# EAGLE schematic MiniRobot (EAGLE 8.3.2)

## Sheet 1 of 3
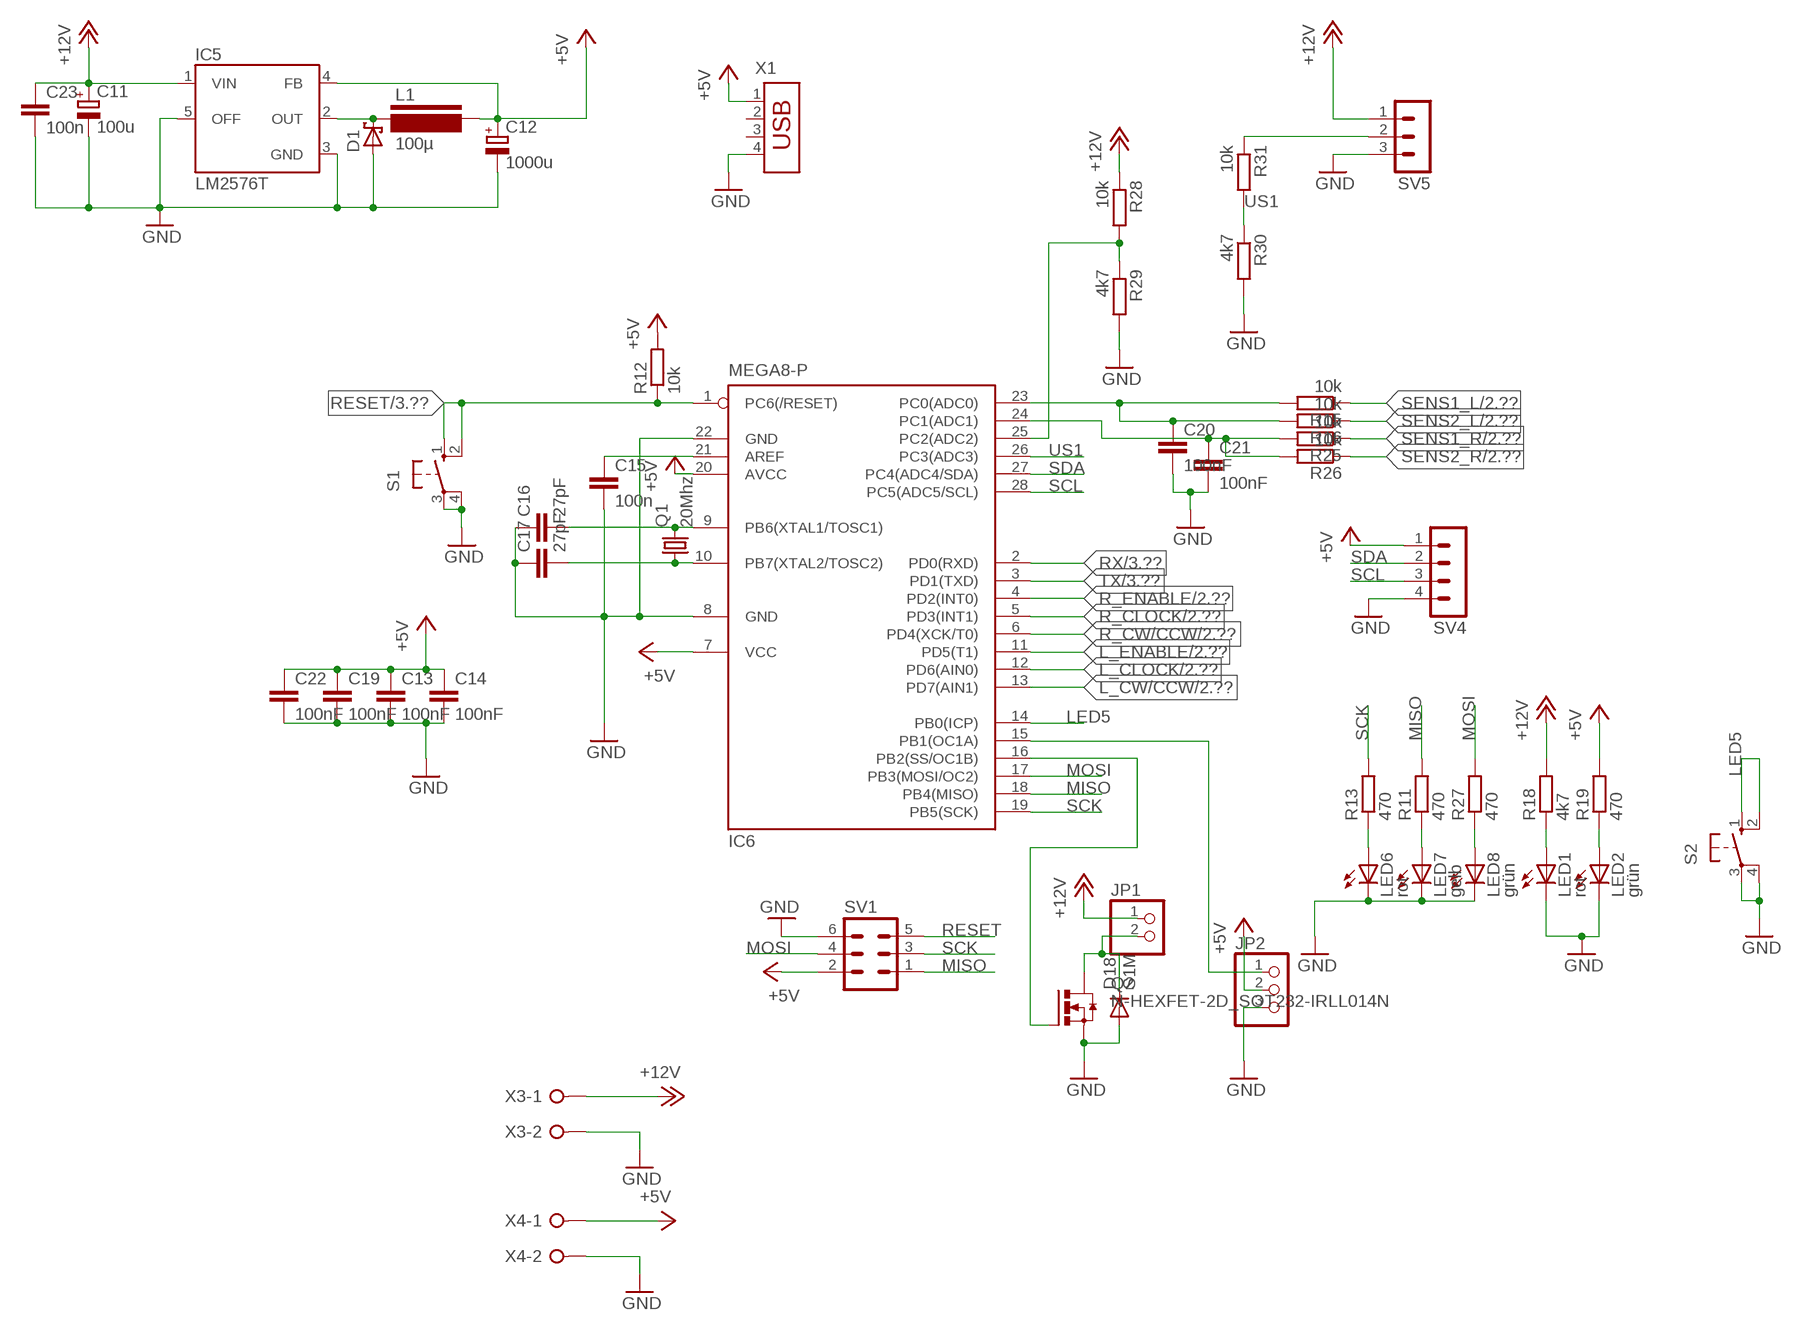
[diagram p0: schematic, sheet 1]

### Parts
C11  100u  CPOL-EUE5-10.5  [E5-10,5]
C12  1000u  CPOL-EUE5-10.5  [E5-10,5]
C13  100nF  C-EUC0805  [C0805]
C14  100nF  C-EUC0805  [C0805]
C15  100n  C-EUC0805  [C0805]
C16  27pF  C-EUC0805  [C0805]
C17  27pF  C-EUC0805  [C0805]
C19  100nF  C-EUC0805  [C0805]
C20  100nF  C-EUC0805  [C0805]
C21  100nF  C-EUC0805  [C0805]
C22  100nF  C-EUC0805  [C0805]
C23  100n  C-EUC0805  [C0805]
D1  SCHOTTKY-DIODEF126Z12  [F126Z12]
D18  S1M  [SMA]
IC5  LM2576T  [TO220-5]
IC6  MEGA8-P  [DIL28-3]
JP1  PINHD-1X2  [1X02]
JP2  PINHD-1X3  [1X03]
L1  100µ  L-PISR  [PISR]
LED1  rot  LEDCHIP-LED0805  [CHIP-LED0805]
LED2  grün  LEDCHIP-LED0805  [CHIP-LED0805]
LED6  rot  LEDCHIP-LED0805  [CHIP-LED0805]
LED7  gelb  LEDCHIP-LED0805  [CHIP-LED0805]
LED8  grün  LEDCHIP-LED0805  [CHIP-LED0805]
Q1  20Mhz  CSM-7X-DU  [CSM-7X-DU]
Q2  N-HEXFET-2D_SOT232-IRLL014N  [SOT223]
R11  470  R-EU_M0805  [M0805]
R12  10k  R-EU_R0805  [R0805]
R13  470  R-EU_M0805  [M0805]
R15  10k  R-EU_R0805  [R0805]
R16  10k  R-EU_M0805  [M0805]
R18  4k7  R-EU_R0805  [R0805]
R19  470  R-EU_M0805  [M0805]
R25  10k  R-EU_M0805  [M0805]
R26  10k  R-EU_M0805  [M0805]
R27  470  R-EU_R0805  [R0805]
R28  10k  R-EU_M0805  [M0805]
R29  4k7  R-EU_M0805  [M0805]
R30  4k7  R-EU_R0805  [R0805]
R31  10k  R-EU_R0805  [R0805]
S1  10-XX  [B3F-10XX]
S2  10-XX  [B3F-10XX]
SV1  ML6  [ML6]
SV4  MA04-1  [MA04-1]
SV5  MA03-1  [MA03-1]
X1  USB-787616  [USB]
X3  W237-02P  [W237-132]
X4  W237-02P  [W237-132]

### Nets
+5V: C12.+ C13.1 C14.1 C19.1 C22.1 IC5.4(FB) IC6.7(VCC) IC6.20(AVCC) JP2.2 L1.P$2 R12.2 R19.2 SV1.2 SV4.1 X1.1 X4.1 ; also sheet 2,3
+12V: C11.+ C23.1 IC5.1(VIN) JP1.1 R18.2 R28.1 SV5.1 X3.1 ; also sheet 2
GND: C11.- C12.- C13.2 C14.2 C15.2 C16.1 C17.1 C19.2 C20.2 C21.2 C22.2 C23.2 D1.A D18.A IC5.3(GND) IC5.5(OFF) IC6.8(GND) IC6.22(GND) JP2.3 LED1.C LED2.C LED6.C LED7.C LED8.C Q2.3(S) R29.2 R30.2 S1.3(P) S1.4(P1) S2.3(P) S2.4(P1) SV1.6 SV4.4 SV5.3 X1.4 X3.2 X4.2 ; also sheet 2,3
L_CLOCK: IC6.12(PD6(AIN0)) ; also sheet 2
L_CW/CCW: IC6.13(PD7(AIN1)) ; also sheet 2
L_ENABLE: IC6.11(PD5(T1)) ; also sheet 2
LED5: IC6.14(PB0(ICP)) S2.1(S) S2.2(S1)
MISO: IC6.18(PB4(MISO)) R11.2 SV1.1
MOSI: IC6.17(PB3(MOSI/OC2)) R27.2 SV1.4
N$8: LED8.A R27.1
N$9: C21.1 IC6.24(PC1(ADC1)) R25.2 R26.2
N$22: C15.1 IC6.21(AREF)
N$28: C16.2 IC6.9(PB6(XTAL1/TOSC1)) Q1.2
N$29: D1.C IC5.2(OUT) L1.P$1
N$31: IC6.25(PC2(ADC2)) R28.2 R29.1
N$35: C17.2 IC6.10(PB7(XTAL2/TOSC2)) Q1.1
N$38: C20.1 IC6.23(PC0(ADC0)) R15.2 R16.2
N$39: LED1.A R18.1
N$40: LED2.A R19.1
N$42: LED6.A R13.1
N$43: LED7.A R11.1
N$44: R31.1 SV5.2
N$46: D18.C JP1.2 Q2.2(D) Q2.4(D)
N$47: IC6.16(PB2(SS/OC1B)) Q2.1(G)
N$48: IC6.15(PB1(OC1A)) JP2.1
R_CLOCK: IC6.5(PD3(INT1)) ; also sheet 2
R_CW/CCW: IC6.6(PD4(XCK/T0)) ; also sheet 2
R_ENABLE: IC6.4(PD2(INT0)) ; also sheet 2
RESET: IC6.1(PC6(/RESET)) R12.1 S1.1(S) S1.2(S1) SV1.5 ; also sheet 3
RX: IC6.2(PD0(RXD)) ; also sheet 3
SCK: IC6.19(PB5(SCK)) R13.2 SV1.3
SCL: IC6.28(PC5(ADC5/SCL)) SV4.3
SDA: IC6.27(PC4(ADC4/SDA)) SV4.2
SENS1_L: R15.1 ; also sheet 2
SENS1_R: R25.1 ; also sheet 2
SENS2_L: R16.1 ; also sheet 2
SENS2_R: R26.1 ; also sheet 2
TX: IC6.3(PD1(TXD)) ; also sheet 3
US1: IC6.26(PC3(ADC3)) R30.1 R31.2
Unconnected: X1.2 X1.3

## Sheet 2 of 3: Motor drivers
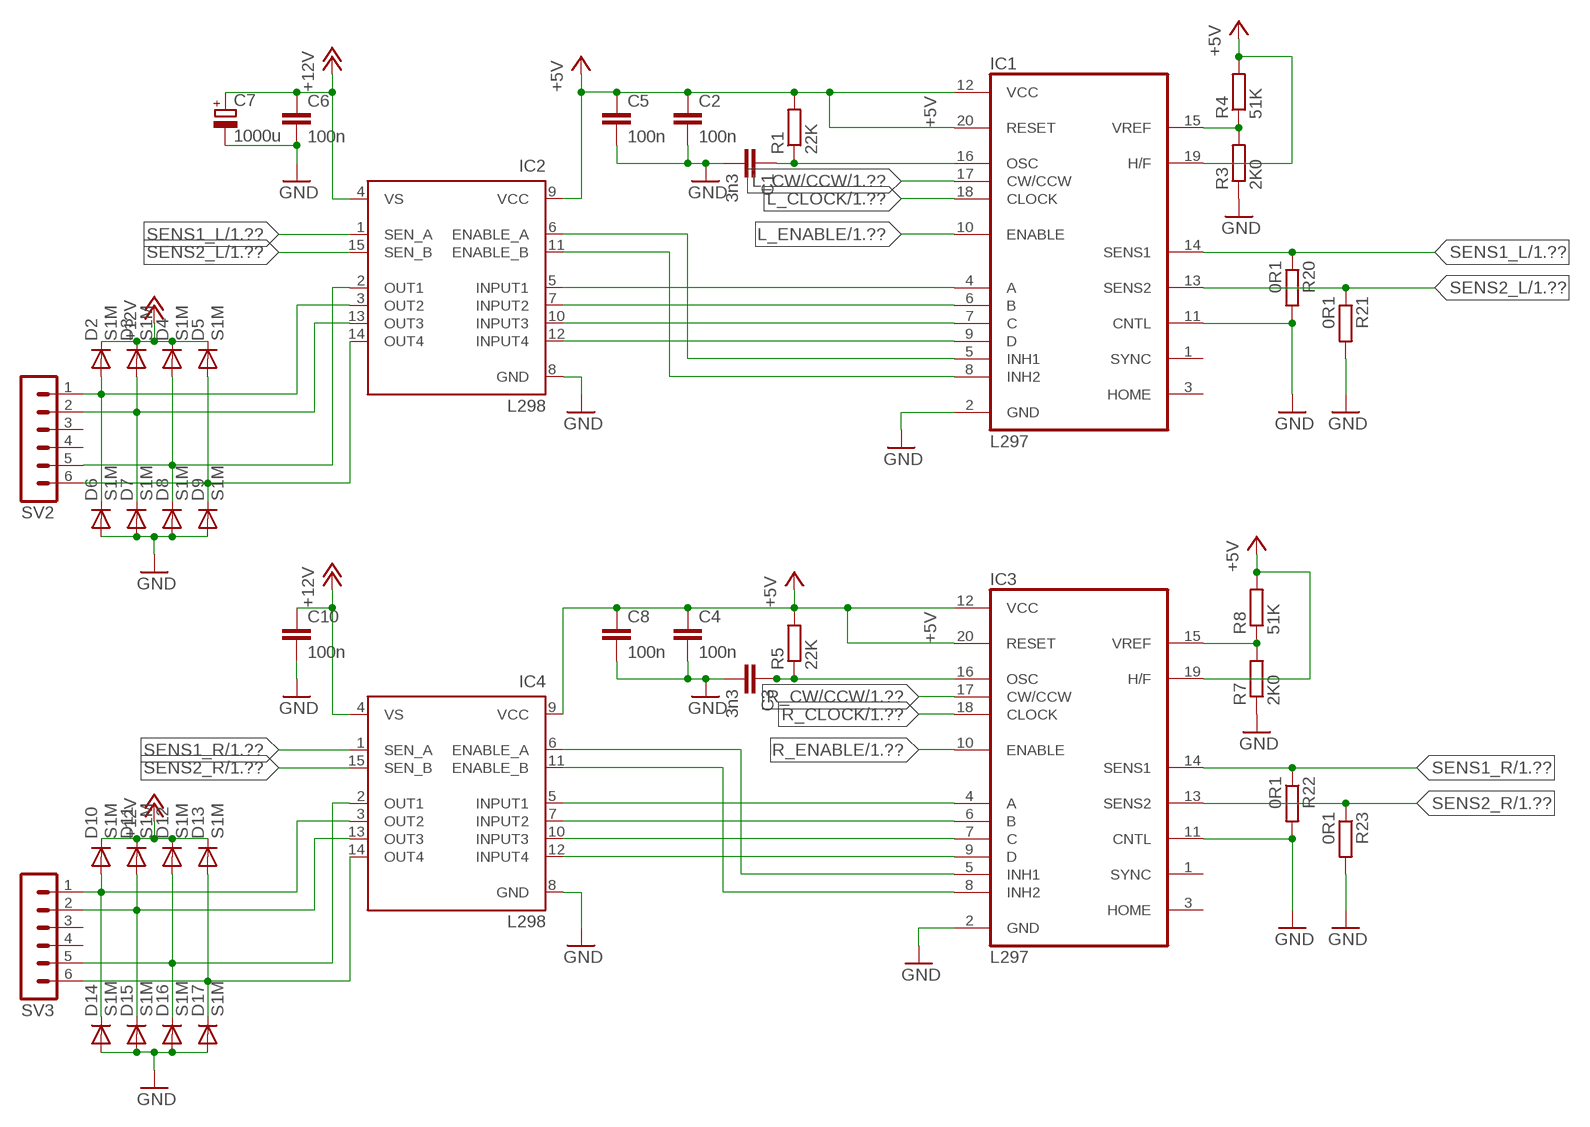
[diagram p1: schematic, sheet 2]

### Parts
C1  3n3  C-EUC0805  [C0805]
C2  100n  C-EUC0805  [C0805]
C3  3n3  C-EUC0805  [C0805]
C4  100n  C-EUC0805  [C0805]
C5  100n  C-EUC0805  [C0805]
C6  100n  C-EUC0805  [C0805]
C7  1000u  CPOL-EUE5-10.5  [E5-10,5]
C8  100n  C-EUC0805  [C0805]
C10  100n  C-EUC0805  [C0805]
D2  S1M  [SMA]
D3  S1M  [SMA]
D4  S1M  [SMA]
D5  S1M  [SMA]
D6  S1M  [SMA]
D7  S1M  [SMA]
D8  S1M  [SMA]
D9  S1M  [SMA]
D10  S1M  [SMA]
D11  S1M  [SMA]
D12  S1M  [SMA]
D13  S1M  [SMA]
D14  S1M  [SMA]
D15  S1M  [SMA]
D16  S1M  [SMA]
D17  S1M  [SMA]
IC1  L297  [DIL20]
IC2  L298  [MULTIWATT-15]
IC3  L297  [DIL20]
IC4  L298  [MULTIWATT-15]
R1  22K  R-EU_R0805  [R0805]
R3  2K0  R-EU_R0805  [R0805]
R4  51K  R-EU_R0805  [R0805]
R5  22K  R-EU_R0805  [R0805]
R7  2K0  R-EU_R0805  [R0805]
R8  51K  R-EU_R0805  [R0805]
R20  0R1  R-EU_0613/15  [P0613/15]
R21  0R1  R-EU_0613/15  [P0613/15]
R22  0R1  R-EU_0613/15  [P0613/15]
R23  0R1  R-EU_0613/15  [P0613/15]
SV2  MA06-1  [MA06-1]
SV3  MA06-1  [MA06-1]

### Nets
+5V: C2.1 C4.1 C5.1 C8.1 IC1.12(VCC) IC1.19(H/F) IC1.20(RESET) IC2.9(VCC) IC3.12(VCC) IC3.19(H/F) IC3.20(RESET) IC4.9(VCC) R1.2 R4.2 R5.2 R8.2 ; also sheet 1,3
+12V: C6.1 C7.+ C10.1 D2.C D3.C D4.C D5.C D10.C D11.C D12.C D13.C IC2.4(VS) IC4.4(VS) ; also sheet 1
GND: C1.2 C2.2 C3.2 C4.2 C5.2 C6.2 C7.- C8.2 C10.2 D6.A D7.A D8.A D9.A D14.A D15.A D16.A D17.A IC1.2(GND) IC1.11(CNTL) IC2.8(GND) IC3.2(GND) IC3.11(CNTL) IC4.8(GND) R3.1 R7.1 R20.2 R21.2 R22.2 R23.2 ; also sheet 1,3
L_CLOCK: IC1.18(CLOCK) ; also sheet 1
L_CW/CCW: IC1.17(CW/CCW) ; also sheet 1
L_ENABLE: IC1.10(ENABLE) ; also sheet 1
N$1: C1.1 IC1.16(OSC) R1.1
N$2: IC1.4(A) IC2.5(INPUT1)
N$3: IC1.6(B) IC2.7(INPUT2)
N$4: IC1.7(C) IC2.10(INPUT3)
N$5: C3.1 IC3.16(OSC) R5.1
N$6: IC3.6(B) IC4.7(INPUT2)
N$7: IC1.9(D) IC2.12(INPUT4)
N$10: IC1.5(INH1) IC2.6(ENABLE_A)
N$11: IC1.15(VREF) R3.2 R4.1
N$12: D4.A D8.C IC2.2(OUT1) SV2.5
N$14: IC3.4(A) IC4.5(INPUT1)
N$15: IC3.7(C) IC4.10(INPUT3)
N$16: IC3.9(D) IC4.12(INPUT4)
N$17: IC3.15(VREF) R7.2 R8.1
N$19: IC3.5(INH1) IC4.6(ENABLE_A)
N$20: IC1.8(INH2) IC2.11(ENABLE_B)
N$23: D2.A D6.C IC2.3(OUT2) SV2.1
N$24: D3.A D7.C IC2.13(OUT3) SV2.2
N$25: D5.A D9.C IC2.14(OUT4) SV2.6
N$26: IC3.8(INH2) IC4.11(ENABLE_B)
N$30: D10.A D14.C IC4.3(OUT2) SV3.1
N$32: D12.A D16.C IC4.2(OUT1) SV3.5
N$33: D13.A D17.C IC4.14(OUT4) SV3.6
N$34: D11.A D15.C IC4.13(OUT3) SV3.2
R_CLOCK: IC3.18(CLOCK) ; also sheet 1
R_CW/CCW: IC3.17(CW/CCW) ; also sheet 1
R_ENABLE: IC3.10(ENABLE) ; also sheet 1
SENS1_L: IC1.14(SENS1) IC2.1(SEN_A) R20.1 ; also sheet 1
SENS1_R: IC3.14(SENS1) IC4.1(SEN_A) R22.1 ; also sheet 1
SENS2_L: IC1.13(SENS2) IC2.15(SEN_B) R21.1 ; also sheet 1
SENS2_R: IC3.13(SENS2) IC4.15(SEN_B) R23.1 ; also sheet 1
Unconnected: IC1.1(SYNC) IC1.3(HOME) IC3.1(SYNC) IC3.3(HOME) SV2.3 SV2.4 SV3.3 SV3.4

## Sheet 3 of 3: FT232RL
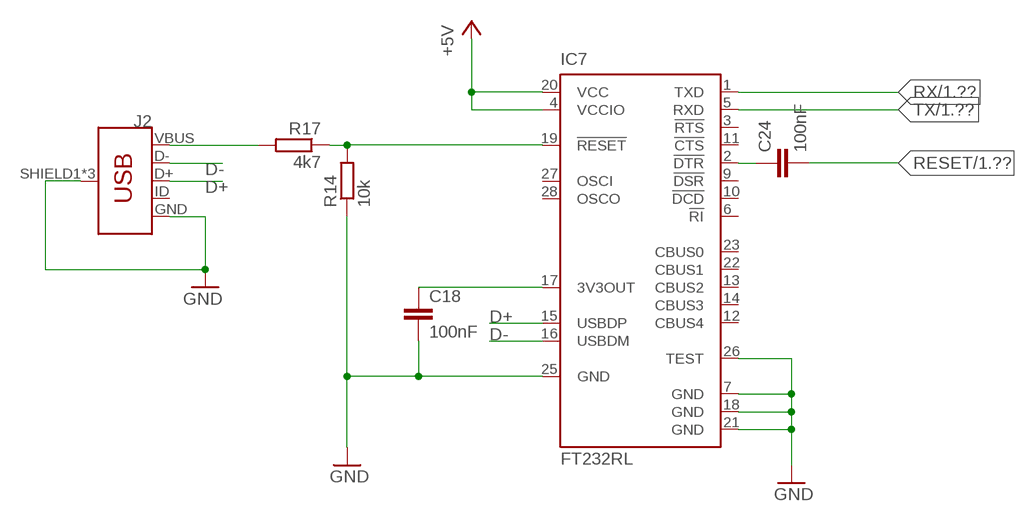
[diagram p2: schematic, sheet 3]

### Parts
C18  100nF  C-EUC0805  [C0805]
C24  100nF  C-EUC0805  [C0805]
IC7  FT232RL  [SSOP28]
J2  USB_MICRO-B_FEMALE-SMT  [USB-B-MICRO-SMD]
R14  10k  R-EU_M0805  [M0805]
R17  4k7  R-EU_M0805  [M0805]

### Nets
+5V: IC7.4(VCCIO) IC7.20(VCC) ; also sheet 1,2
D+: IC7.15(USBDP) J2.D+
D-: IC7.16(USBDM) J2.D-
GND: C18.2 IC7.7(GND) IC7.18(GND) IC7.21(GND) IC7.25(GND) IC7.26(TEST) J2.GND J2.SHIELD1(SHIELD) J2.SHIELD2(SHIELD) J2.SHIELD3(SHIELD) R14.1 ; also sheet 1,2
N$27: J2.VBUS R17.2
N$36: IC7.19(!RESET) R14.2 R17.1
N$37: C18.1 IC7.17(3V3OUT)
N$45: C24.1 IC7.2(!DTR)
RESET: C24.2 ; also sheet 1
RX: IC7.1(TXD) ; also sheet 1
TX: IC7.5(RXD) ; also sheet 1
Unconnected: IC7.3(!RTS) IC7.6(!RI) IC7.9(!DSR) IC7.10(!DCD) IC7.11(!CTS) IC7.12(CBUS4) IC7.13(CBUS2) IC7.14(CBUS3) IC7.22(CBUS1) IC7.23(CBUS0) IC7.27(OSCI) IC7.28(OSCO) J2.ID

## Library data of the parts
C1-C6 C8 C10 C23 = resistor:C-EU: CAPACITOR, European symbol
C7 C11 C12 = resistor:CPOL-EU: POLARIZED CAPACITOR, European symbol
C13-C22 C24 = rcl:C-EU: CAPACITOR, European symbol
D1 = diode:SCHOTTKY-DIODE: Schottky Diode
D2-D18 = diode:S1M
IC1 IC3 = st-microelectronics:L297: STEPPER MOTOR CONTROLLER; MPN: L297/1; OC_FARNELL: 1094209; OC_NEWARK: 56P8258
IC2 IC4 = st-microelectronics:L298: DUAL FULL-BRIDGE DRIVER; MPN: L298N; OC_FARNELL: 1589425; OC_NEWARK: 32M1527
IC5 = v-reg-3:LM2576: National Semiconductor <http://www.national.com> 3.0A "Simple Switcher"(c) 52kHz, Vout 1.23-37V (HV: 57V), Vin 40V (HV: 60V), 50µA standby current
IC6 = atmel:MEGA8-P: MICROCONTROLLER 8 Kbytes FLASH, 1 kbytes SRAM, 512 bytes EEPROM, USART, 4-channel 10 bit ADC, 2-channel 8 bit ADC Pin compatible with Atmega48, ATMega88, ATMega168 Source: avr.lbr; OC_FARNELL: unknown; OC_NEWARK: unknown
IC7 = ftdichip:FT232R: Source: http://www.ftdichip.com/Documents/DataSheets/DS_FT232R_v104.pdf; MPN: FT232RL; OC_FARNELL: 1146032; OC_NEWARK: 91K9918
J2 = SparkFun-Connectors:USB_MICRO-B: USB Type Micro-B Connector Male/female and PTH/SMT variants SparkFun Products: SparkFun microB USB Breakout <https://www.sparkfun.com/products/12035> SparkFun USB microB Plug Breakout <https://www.sparkfun.com/products/10031> SparkFun ESP8266 Thing <https://www.sparkfun.com/products/13231>; PROD_ID: CONN-11752
JP1 = pinhead:PINHD-1X2: PIN HEADER
JP2 = pinhead:PINHD-1X3: PIN HEADER
L1 = L-PISR:L-PISR: Fastron SMD Power Inductors (also Shielded) - PISR Series Data Sheet <http://www.fastrongroup.com/products/inductors/pdf/PISR.pdf> Part No Inductance L (µH) fL (MHz) Tol ± (%) SRF min (MHz) DCR max (Ω) Rated DC Current | sat (A) | Δ T = 40°C (A) PISR-1R0M-04 1.0 0.1 20 164 0.009 21 8.60 PISR-2R2M-04 2.2 0.1 20 95 0.014 16 7.10 PISR-3R3M-04 3.3 0.1 20 72 0.017 15 6.40 PISR-4R7M-04 4.7 0.1 20 52 0.019 13 5.80 PISR-5R6M-04 5.6 0.1 20 41 0.022 12 5.50 PISR-6R8M-04 6.8 0.1 20 35 0.024 11 5.20 PISR-100M-04 10 0.1 20 24 0.029 10 4.50 PISR-150M-04 15 0.1 20 20 0.035 8.0 4.10 PISR-220M-04 22 0.1 20 15 0.04 7.0 3.60 PISR-330M-04 33 0.1 20 10 0.06 5.6 3.10 PISR-470M-04 47 0.1 20 8 0.07 4.6 2.70 PISR-680M-04 68 0.1 20 6.5 0.10 3.6 2.30 PISR-101M-04 100 0.1 20 5.2 0.17 3.1 1.90 PISR-151M-04 150 0.1 20 4.2 0.22 2.6 1.60 PISR-221M-04 220 0.1 20 3.3 0.34 2.2 1.30 PISR-331M-04 330 0.1 20 2.7 0.52 1.9 1.10 PISR-471M-04 470 0.1 20 2.1 0.76 1.4 0.85 PISR-681M-04 680 0.1 20 1.8 1.1 1.2 0.74 PISR-102M-04 1000 0.1 20 1.3 1.7 1.0 0.57
LED1 LED2 LED6-LED8 = led:LED: LED OSRAM: - CHIPLED LG R971, LG N971, LY N971, LG Q971, LY Q971, LO R971, LY R971 LH N974, LH R974 LS Q976, LO Q976, LY Q976 LO Q996 - Hyper CHIPLED LW Q18S LB Q993, LB Q99A, LB R99A - SideLED LS A670, LO A670, LY A670, LG A670, LP A670 LB A673, LV A673, LT A673, LW A673 LH A674 LY A675 LS A676, LA A676, LO A676, LY A676, LW A676 LS A679, LY A679, LG A679 - Hyper Micro SIDELED® LS Y876, LA Y876, LO Y876, LY Y876 LT Y87S - SmartLED LW L88C, LW L88S LB L89C, LB L89S, LG L890 LS L89K, LO L89K, LY L89K LS L896, LA L896, LO L896, LY L896 - TOPLED LS T670, LO T670, LY T670, LG T670, LP T670 LSG T670, LSP T670, LSY T670, LOP T670, LYG T670 LG T671, LOG T671, LSG T671 LB T673, LV T673, LT T673, LW T673 LH T674 LS T676, LA T676, LO T676, LY T676, LB T676, LH T676, LSB T676, LW T676 LB T67C, LV T67C, LT T67C, LS T67K, LO T67K, LY T67K, LW E67C LS E67B, LA E67B, LO E67B, LY E67B, LB E67C, LV E67C, LT E67C LW T67C LS T679, LY T679, LG T679 LS T770, LO T770, LY T770, LG T770, LP T770 LB T773, LV T773, LT T773, LW T773 LH T774 LS E675, LA E675, LY E675, LS T675 LS T776, LA T776, LO T776, LY T776, LB T776 LHGB T686 LT T68C, LB T68C - Hyper Mini TOPLED® LB M676 - Mini TOPLED Santana® LG M470 LS M47K, LO M47K, LY M47K Source: http://www.osram.convergy.de LUXEON: - LUMILED® LXK2-PW12-R00, LXK2-PW12-S00, LXK2-PW14-U00, LXK2-PW14-V00 LXK2-PM12-R00, LXK2-PM12-S00, LXK2-PM14-U00 LXK2-PE12-Q00, LXK2-PE12-R00, LXK2-PE12-S00, LXK2-PE14-T00, LXK2-PE14-U00 LXK2-PB12-K00, LXK2-PB12-L00, LXK2-PB12-M00, LXK2-PB14-N00, LXK2-PB14-P00, LXK2-PB14-Q00 LXK2-PR12-L00, LXK2-PR12-M00, LXK2-PR14-Q00, LXK2-PR14-R00 LXK2-PD12-Q00, LXK2-PD12-R00, LXK2-PD12-S00 LXK2-PH12-R00, LXK2-PH12-S00 LXK2-PL12-P00, LXK2-PL12-Q00, LXK2-PL12-R00 Source: www.luxeon.com KINGBRIGHT: KA-3528ASYC Source: www.kingbright.com
Q1 = crystal:CSM-7X-DU: SMD CRYSTAL Source: www.ecsxtal.com .. Crystal 3.6864MHz CSM_7X_DU.PDF; OC_FARNELL: unknown; OC_NEWARK: unknown
Q2 = transistor-power:N-HEXFET-2D_?-*: HEXFET® Power MOSFET 2 Drain connects http://www.irf.com/product-info/datasheets/data/irll014n.pdf
R1 R3-R5 R7 R8 R11-R23 R25-R31 = resistor:R-EU_: RESISTOR, European symbol
S1 S2 = switch-omron:10-XX: OMRON SWITCH; MPN: B3F-1000; OC_FARNELL: 176432; OC_NEWARK: 36M3542
SV1 = con-harting-ml:ML6: HARTING; OC_FARNELL: unknown; OC_NEWARK: unknown
SV2 SV3 = con-lstb:MA06-1: PIN HEADER; OC_FARNELL: unknown; OC_NEWARK: unknown
SV4 = con-lstb:MA04-1: PIN HEADER; OC_FARNELL: unknown; OC_NEWARK: unknown
SV5 = con-lstb:MA03-1: PIN HEADER; OC_FARNELL: unknown; OC_NEWARK: unknown
X1 = con-amp:USB-787616: AMP connector
X3 X4 = con-wago-508:W237-02P: WAGO SREW CLAMP; OC_FARNELL: unknown; OC_NEWARK: unknown